# EAGLE schematic sram (EAGLE 6.5.0)
SRAM
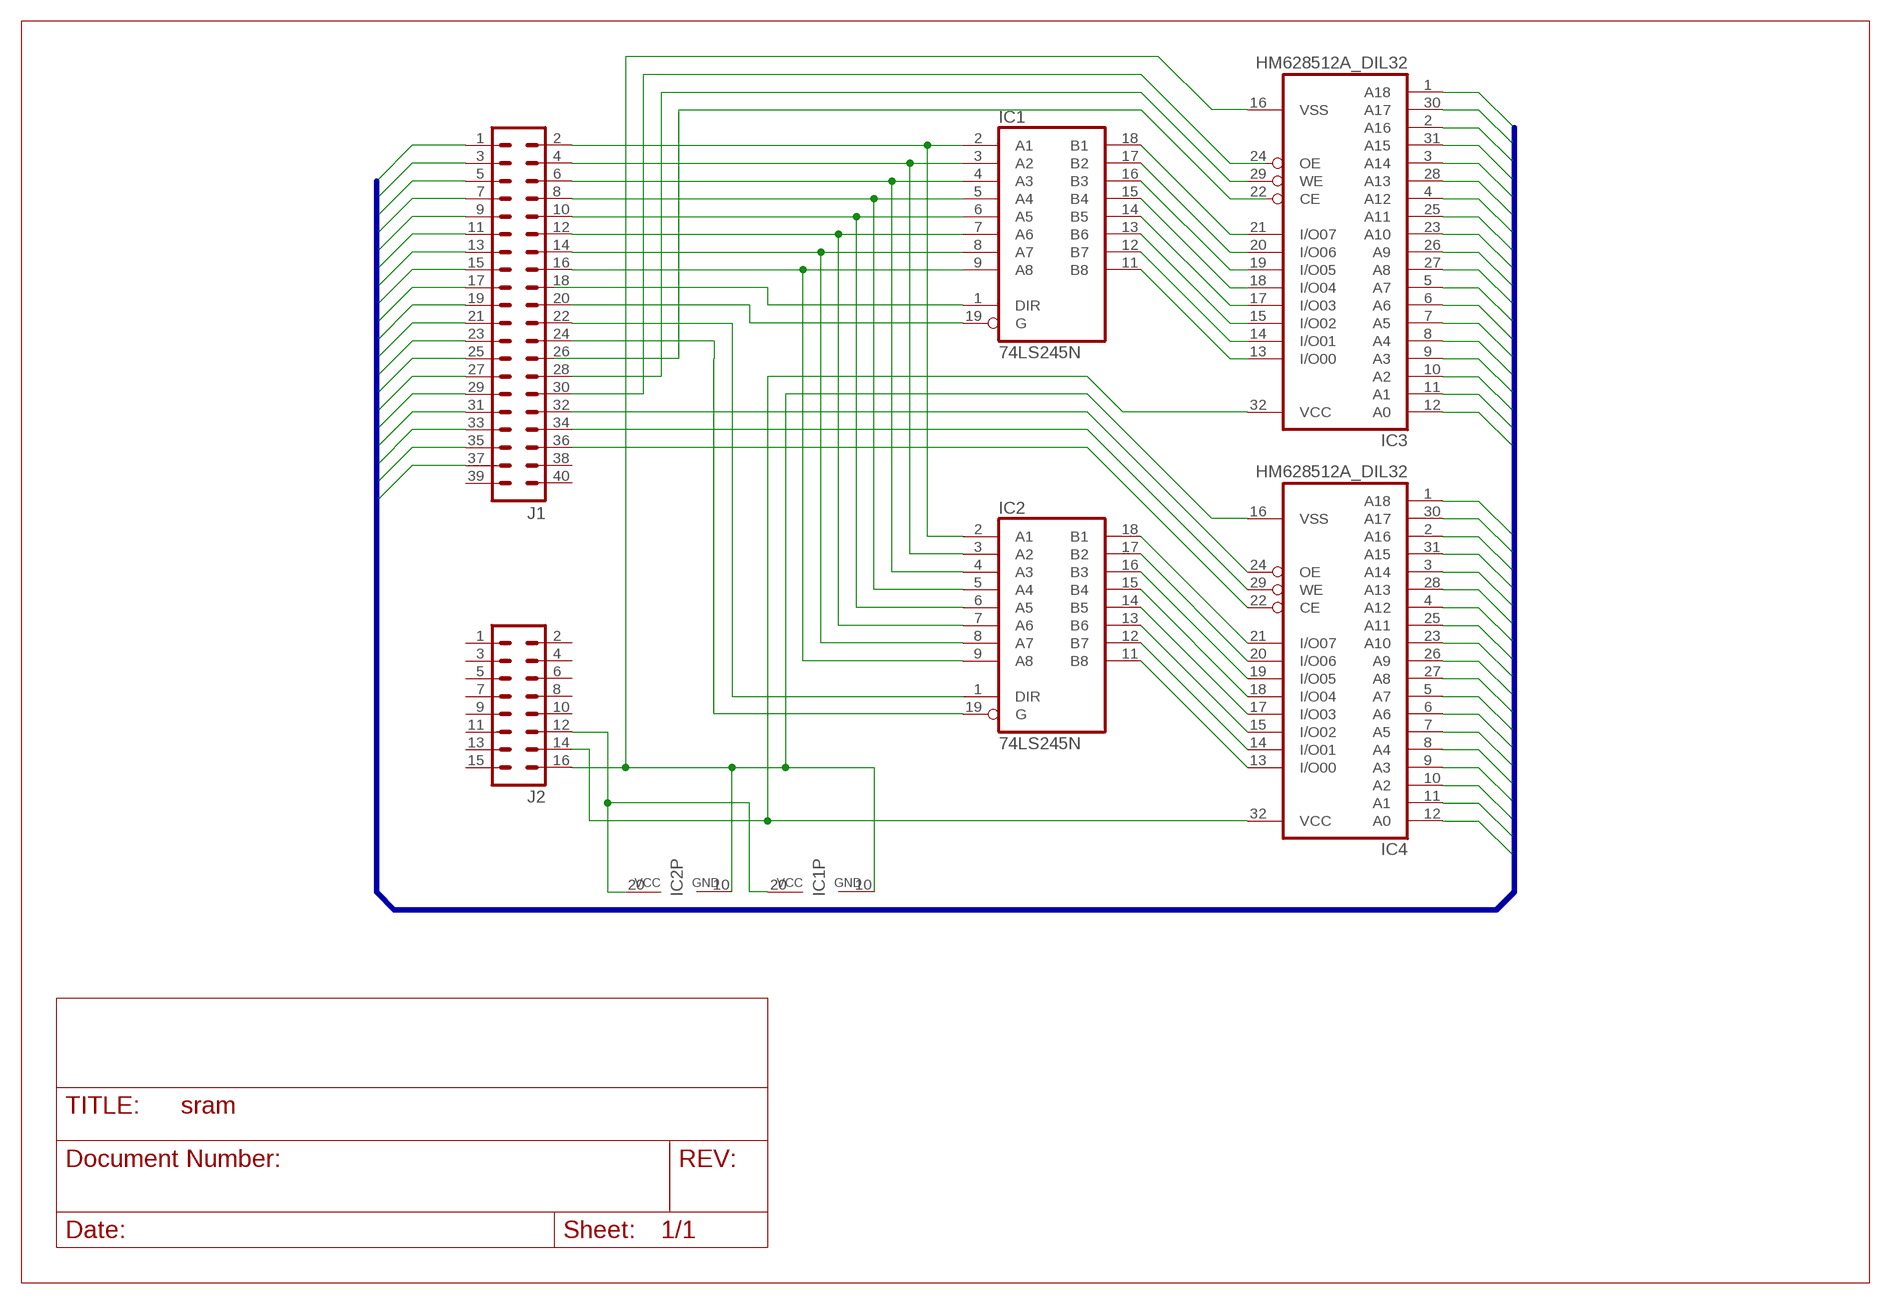
[diagram p0: schematic, sheet 1]

## Parts
IC1  74LS245N  [DIL20]
IC2  74LS245N  [DIL20]
IC3  HM628512A_DIL32  [DIL32]
IC4  HM628512A_DIL32  [DIL32]
J1  ML40  [ML40]
J2  ML16  [ML16]

## Nets
N$1: IC1.18(B1) IC3.21(I/O07)
N$2: IC1.17(B2) IC3.20(I/O06)
N$3: IC1.16(B3) IC3.19(I/O05)
N$4: IC1.15(B4) IC3.18(I/O04)
N$5: IC1.14(B5) IC3.17(I/O03)
N$6: IC1.13(B6) IC3.15(I/O02)
N$7: IC1.12(B7) IC3.14(I/O01)
N$8: IC1.11(B8) IC3.13(I/O00)
N$9: IC2.18(B1) IC4.21(I/O07)
N$10: IC2.17(B2) IC4.20(I/O06)
N$11: IC2.16(B3) IC4.19(I/O05)
N$12: IC2.15(B4) IC4.18(I/O04)
N$13: IC2.14(B5) IC4.17(I/O03)
N$14: IC2.13(B6) IC4.15(I/O02)
N$15: IC2.12(B7) IC4.14(I/O01)
N$16: IC2.11(B8) IC4.13(I/O00)
N$17: IC3.32(VCC) IC4.32(VCC) J2.14
N$18: IC1.3(A2) IC2.3(A2) J1.4
N$19: IC1.4(A3) IC2.4(A3) J1.6
N$20: IC1.5(A4) IC2.5(A4) J1.8
N$21: IC1.6(A5) IC2.6(A5) J1.10
N$22: IC1.7(A6) IC2.7(A6) J1.12
N$23: IC1.8(A7) IC2.8(A7) J1.14
N$24: IC1.9(A8) IC2.9(A8) J1.16
N$25: IC4.12(A0)
N$26: IC4.11(A1)
N$27: IC4.10(A2)
N$28: IC4.9(A3)
N$29: IC4.8(A4)
N$30: IC4.7(A5)
N$31: IC4.6(A6)
N$32: IC4.5(A7)
N$33: IC4.27(A8)
N$34: IC4.26(A9)
N$35: IC4.23(A10)
N$36: IC4.25(A11)
N$37: IC4.4(A12)
N$38: IC4.28(A13)
N$39: IC4.3(A14)
N$40: IC4.31(A15)
N$41: IC4.2(A16)
N$42: IC4.30(A17)
N$43: IC4.1(A18)
N$63: J1.1
N$64: J1.3
N$65: J1.5
N$66: J1.7
N$67: J1.9
N$68: J1.11
N$69: J1.13
N$70: J1.15
N$71: J1.17
N$72: J1.19
N$73: J1.21
N$74: J1.23
N$75: J1.25
N$76: J1.27
N$77: J1.29
N$78: J1.31
N$79: J1.33
N$80: J1.35
N$81: J1.37
N$82: IC2.1(DIR) J1.22
N$83: J1.24
N$85: IC2.19(G)
N$87: IC3.29(WE) J1.28
N$88: J1.30
N$89: J1.32
N$90: IC4.29(WE) J1.34
N$91: IC4.22(CE) J1.36
N$92: IC1.2(A1) IC2.2(A1) IC4.24(OE) J1.2
N$94: IC1.10(GND) IC2.10(GND) IC3.16(VSS) IC4.16(VSS) J2.16
N$95: IC1.20(VCC) IC2.20(VCC) J2.12
N$96: IC1.19(G) J1.20
N$97: IC1.1(DIR)
Unconnected: IC3.1(A18) IC3.2(A16) IC3.3(A14) IC3.4(A12) IC3.5(A7) IC3.6(A6) IC3.7(A5) IC3.8(A4) IC3.9(A3) IC3.10(A2) IC3.11(A1) IC3.12(A0) IC3.22(CE) IC3.23(A10) IC3.24(OE) IC3.25(A11) IC3.26(A9) IC3.27(A8) IC3.28(A13) IC3.30(A17) IC3.31(A15) J1.18 J1.26 J1.38 J1.39 J1.40 J2.1 J2.2 J2.3 J2.4 J2.5 J2.6 J2.7 J2.8 J2.9 J2.10 J2.11 J2.13 J2.15

## Buses
B$1

## Library data of the parts
IC1 IC2 = 74xx-eu:74*245: Octal BUS TRANSCEIVER, 3-state
IC3 IC4 = hitachi_sram_hm628512a-series_rev1:HM628512A_DIL32: 4M SRAM 512kword x 8bit
J1 = con-harting-ml:ML40: HARTING; OC_FARNELL: unknown; OC_NEWARK: unknown
J2 = con-harting-ml:ML16: HARTING; OC_FARNELL: unknown; OC_NEWARK: unknown